# EAGLE design Module (EAGLE 6.4)
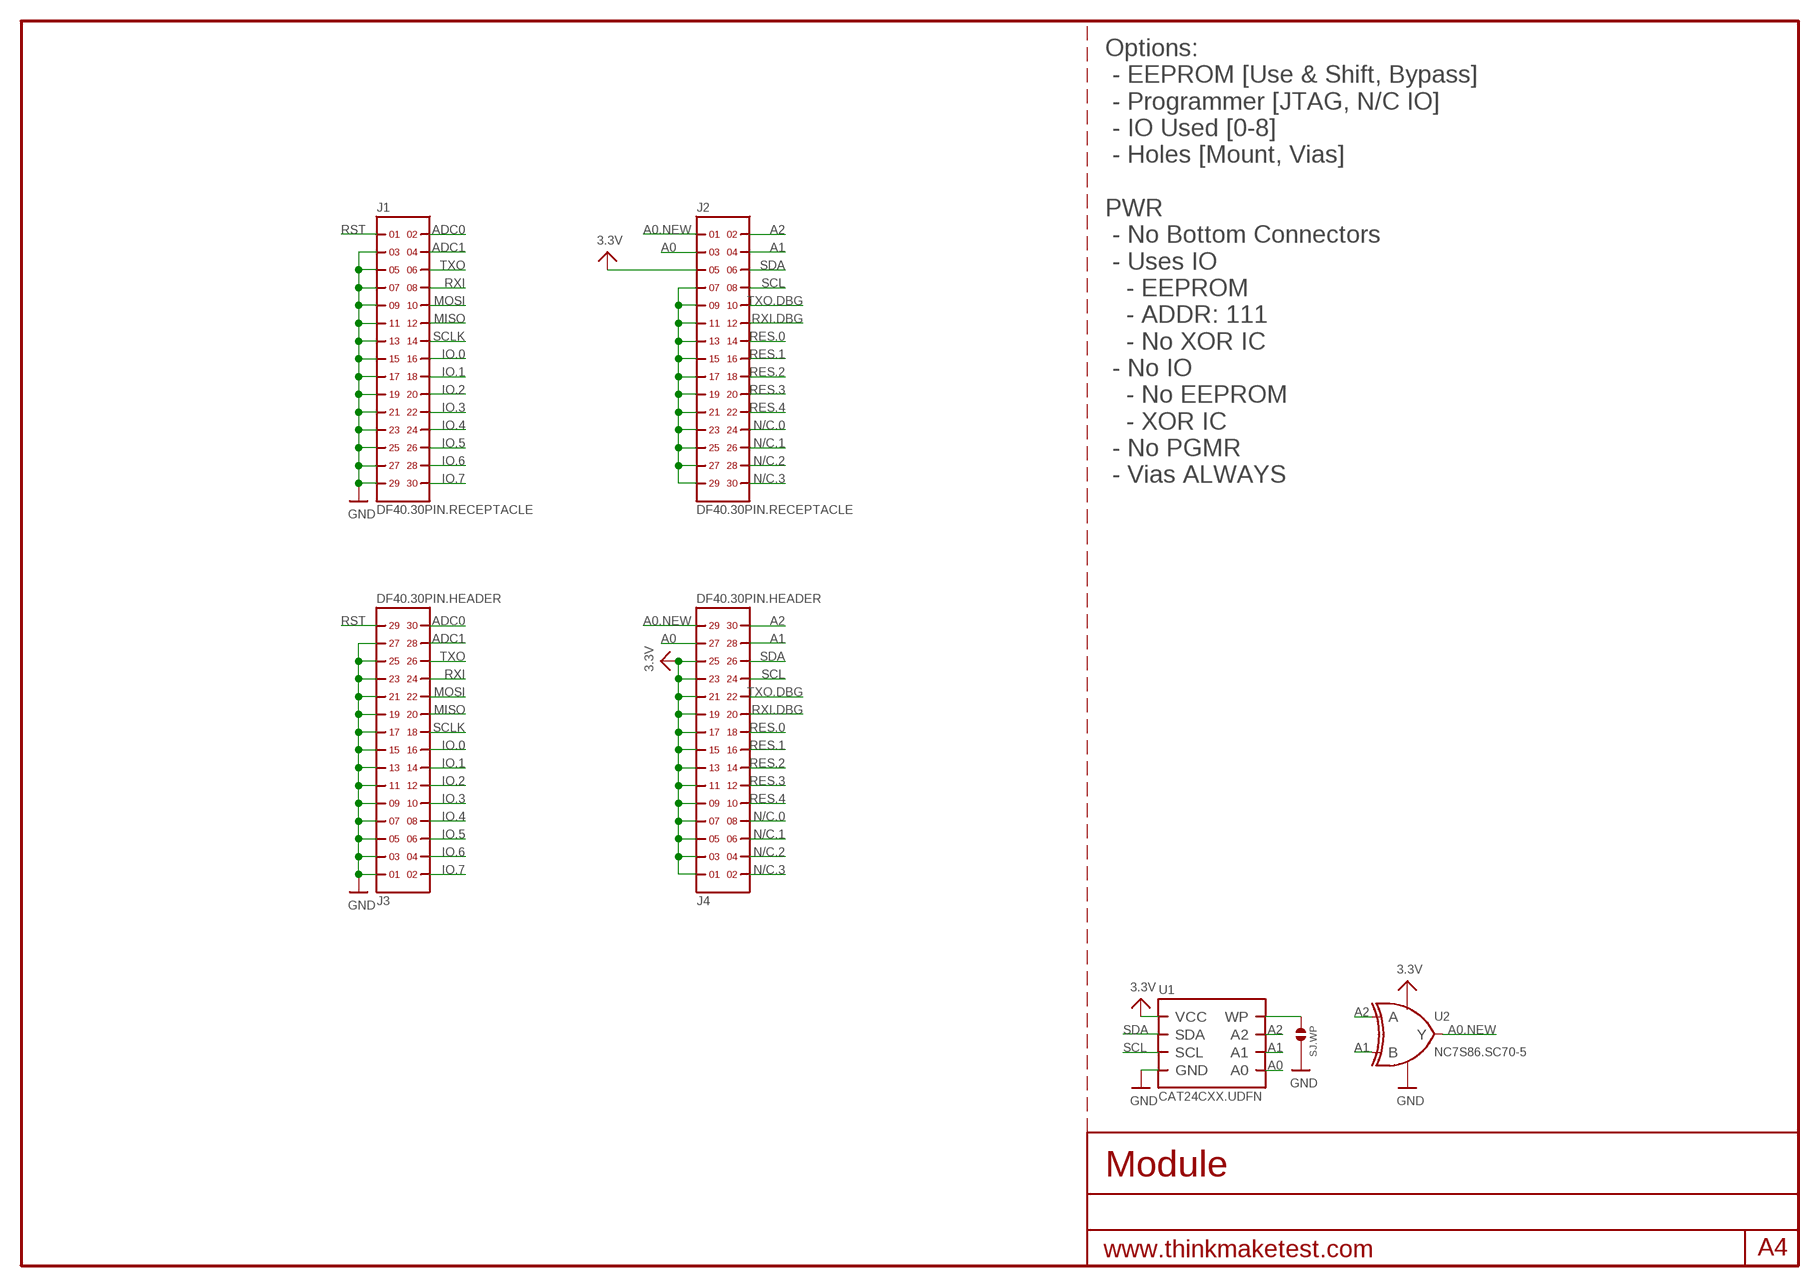
[diagram p0: schematic, sheet 1]

## Parts
J1  DF40.30PIN.RECEPTACLE  [DF40(XX)-30DS-0.4V]
J2  DF40.30PIN.RECEPTACLE  [DF40(XX)-30DS-0.4V]
J3  DF40.30PIN.HEADER  [DF40(XX)-30DP-0.4V]
J4  DF40.30PIN.HEADER  [DF40(XX)-30DP-0.4V]
SJ.WP  SOLDERJUMPER.2.MED  [2.MED]
U1  CAT24CXX.UDFN  [UDFN8.2X3MM]
U2  NC7S86.SC70-5  [SC70-5]

## Nets
3.3V: J2.5 J4.1 J4.3 J4.5 J4.7 J4.9 J4.11 J4.13 J4.15 J4.17 J4.19 J4.21 J4.23 J4.25 U1.8(VCC) U2.6(VCC)
A0: J2.3 J4.27 U1.1(A0)
A0.NEW: J2.1 J4.29 U2.4(Y)
A1: J2.4 J4.28 U1.2(A1) U2.2(B)
A2: J2.2 J4.30 U1.3(A2) U2.1(A)
ADC0: J1.2 J3.30
ADC1: J1.4 J3.28
GND: J1.3 J1.5 J1.7 J1.9 J1.11 J1.13 J1.15 J1.17 J1.19 J1.21 J1.23 J1.25 J1.27 J1.29 J3.1 J3.3 J3.5 J3.7 J3.9 J3.11 J3.13 J3.15 J3.17 J3.19 J3.21 J3.23 J3.25 J3.27 SJ.WP.2 U1.4(GND) U1.PAD(GND) U2.3(GND)
IO.0: J1.16 J3.16
IO.1: J1.18 J3.14
IO.2: J1.20 J3.12
IO.3: J1.22 J3.10
IO.4: J1.24 J3.8
IO.5: J1.26 J3.6
IO.6: J1.28 J3.4
IO.7: J1.30 J3.2
MISO: J1.12 J3.20
MOSI: J1.10 J3.22
N$1: SJ.WP.1 U1.7(WP)
N$2: J2.7 J2.9 J2.11 J2.13 J2.15 J2.17 J2.19 J2.21 J2.23 J2.25 J2.27 J2.29
N/C.0: J2.24 J4.8
N/C.1: J2.26 J4.6
N/C.2: J2.28 J4.4
N/C.3: J2.30 J4.2
RES.0: J2.14 J4.18
RES.1: J2.16 J4.16
RES.2: J2.18 J4.14
RES.3: J2.20 J4.12
RES.4: J2.22 J4.10
RST: J1.1
RXI: J1.8 J3.24
RXI.DBG: J2.12 J4.20
SCL: J2.8 J4.24 U1.6(SCL)
SCLK: J1.14 J3.18
SDA: J2.6 J4.26 U1.5(SDA)
TXO: J1.6 J3.26
TXO.DBG: J2.10 J4.22
Unconnected: J3.29

## Notes on the sheet
- Options:
   - EEPROM [Use & Shift, Bypass]
   - Programmer [JTAG, N/C IO]
   - IO Used [0-8]
   - Holes [Mount, Vias]
- PWR
   - No Bottom Connectors
   - Uses IO
     - EEPROM
     - ADDR: 111
     - No XOR IC
   - No IO
     - No EEPROM
     - XOR IC
   - No PGMR
   - Vias ALWAYS

## Library data of the parts
J1-J4 = hirose:DF40.30PIN
SJ.WP = solderjumper:SOLDERJUMPER.2
U1 = on-semiconductor:CAT24CXX
U2 = fairchild:NC7S86

## Board
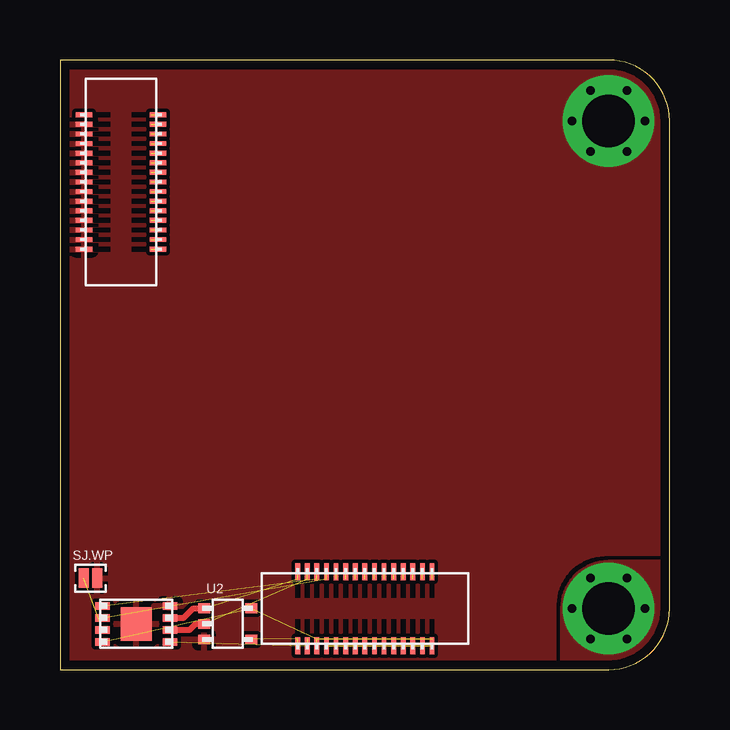
[diagram p1: board, top side]
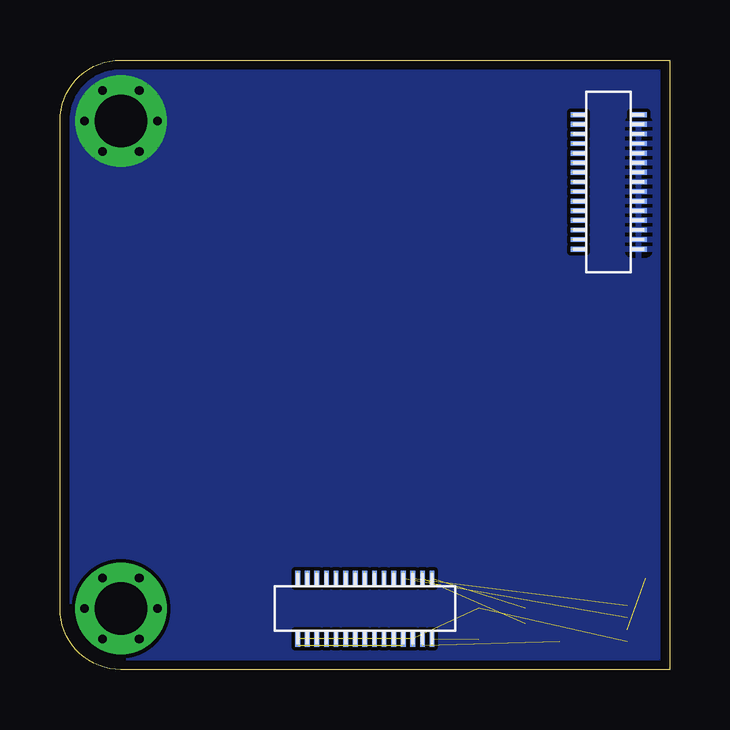
[diagram p2: board, bottom side, seen from below]

Size 25.4 x 25.4 mm. Coordinates in mm from the lower left corner, seen from the top.
Outline: 22.86,25.4 0,25.4 0,0 22.86,0 arc90 25.4,2.54 25.4,22.86 arc90 22.86,25.4
Copper layers (1*16): Top 0.0356mm / dielectric 1.5011mm / Bottom 0.0356mm
Design rules "default": minimum track width 6mil, minimum drill 13mil, track to track 6mil, track to pad 6mil, pad to pad 6mil, via to via 6mil, smd to smd 6mil, copper to edge 15mil, drill to drill 6mil, minimum pad ring 7mil, minimum via ring 7mil, stop-mask expansion 4mil, vias tented up to drill 16mil, thermal gap 10mil

### Footprints (pad centres in the part's own frame; a part is rotated, then mirrored left to right if it is on the bottom)
DF40(XX)-30DS-0.4V = smd 0.2 x 0.7: 1 -2.8,-1.54; 2 -2.8,1.54; 3 -2.4,-1.54; 4 -2.4,1.54; 5 -2,-1.54; 6 -2,1.54; 7 -1.6,-1.54; 8 -1.6,1.54; 9 -1.2,-1.54; 10 -1.2,1.54; 11 -0.8,-1.54; 12 -0.8,1.54; 13 -0.4,-1.54; 14 -0.4,1.54; 15 0,-1.54; 16 0,1.54; 17 0.4,-1.54; 18 0.4,1.54; 19 0.8,-1.54; 20 0.8,1.54; 21 1.2,-1.54; 22 1.2,1.54; 23 1.6,-1.54; 24 1.6,1.54; 25 2,-1.54; 26 2,1.54; 27 2.4,-1.54; 28 2.4,1.54; 29 2.8,-1.54; 30 2.8,1.54
DF40(XX)-30DP-0.4V = smd 0.2 x 0.66: 1 -2.8,-1.255; 2 -2.8,1.255; 3 -2.4,-1.255; 4 -2.4,1.255; 5 -2,-1.255; 6 -2,1.255; 7 -1.6,-1.255; 8 -1.6,1.255; 9 -1.2,-1.255; 10 -1.2,1.255; 11 -0.8,-1.255; 12 -0.8,1.255; 13 -0.4,-1.255; 14 -0.4,1.255; 15 0,-1.255; 16 0,1.255; 17 0.4,-1.255; 18 0.4,1.255; 19 0.8,-1.255; 20 0.8,1.255; 21 1.2,-1.255; 22 1.2,1.255; 23 1.6,-1.255; 24 1.6,1.255; 25 2,-1.255; 26 2,1.255; 27 2.4,-1.255; 28 2.4,1.255; 29 2.8,-1.255; 30 2.8,1.255
2.MED = smd 0.406 x 0.813: 1 -0.279,0; 2 0.279,0
UDFN8.2X3MM = smd 0.32 x 0.6: 1 -0.75,-1.4; 2 -0.25,-1.4; 3 0.25,-1.4; 4 0.75,-1.4; 5 0.75,1.4; 6 0.25,1.4; 7 -0.25,1.4; 8 -0.75,1.4 | smd 1.4 x 1.3: PAD 0,0
SC70-5 = smd 0.4 x 0.5: 1 -0.65,-0.975; 2 0,-0.975; 3 0.65,-0.975; 4 0.65,0.975; 6 -0.65,0.975

### Placement (x,y rotation side)
J1  2.54,20.32 270 top
J2  12.7,2.54 0 top
J3  2.54,20.32 90 bottom
J4  12.7,2.54 0 bottom
SJ.WP  1.27,3.81 0 top
U1  3.17,1.91 90 top
U2  6.99,1.91 270 top

### Tracks (layer width: path | path; a pad name or v marks a point on that pad's centre or on a via)
3.3V  (15 unrouted)
A0  (2 unrouted)
A0.NEW  (2 unrouted)
A1  (2 unrouted)
  Top 0.254: U1.2 5.41,1.66 5.66,1.91 U2.2
A2  (2 unrouted)
  Top 0.254: U1.3 5.16,2.15 5.55,2.56 U2.1
ADC0  (1 unrouted)
ADC1  (1 unrouted)
GND  (via drill 0.36, 2.18 pad 3.81)
  other vias: 22.86,22.86 21.34,22.86 24.38,22.86 22.1,24.13 23.62,24.13 23.62,21.59 22.1,21.59
  pour Bottom (rank 6): 0,0 25.4,0 25.4,25.4 0,25.4
  pour Top (rank 6): 0,0 25.4,0 25.4,25.4 0,25.4
IO.0  (1 unrouted)
IO.1  (1 unrouted)
IO.2  (1 unrouted)
IO.3  (1 unrouted)
IO.4  (1 unrouted)
IO.5  (1 unrouted)
IO.6  (1 unrouted)
IO.7  (1 unrouted)
MISO  (1 unrouted)
MOSI  (1 unrouted)
N$1  (1 unrouted)
N$2  (11 unrouted)
N/C.0  (1 unrouted)
N/C.1  (1 unrouted)
N/C.2  (1 unrouted)
N/C.3  (1 unrouted)
RES.0  (1 unrouted)
RES.1  (1 unrouted)
RES.2  (1 unrouted)
RES.3  (1 unrouted)
RES.4  (1 unrouted)
RXI  (1 unrouted)
RXI.DBG  (1 unrouted)
SCL  (2 unrouted)
SCLK  (1 unrouted)
SDA  (2 unrouted)
TXO  (1 unrouted)
TXO.DBG  (1 unrouted)
VIN  (via drill 0.36, 2.18 pad 3.81)
  other vias: 22.86,2.54 24.38,2.54 21.34,2.54 22.1,3.81 23.62,3.81 23.62,1.27 22.1,1.27
  pour Top: 25.4,4.45 22.86,4.45 arc90 20.95,2.54 20.95,0 22.86,0 arc90 25.4,2.54

### Text on the board
bDocu: AnomalousMaker.com | Cruz Monrreal II | v1